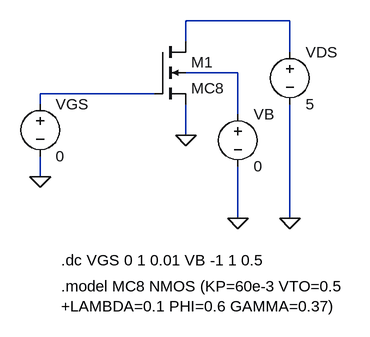
[diagram p0: schematic MOSFET_transfer_body_effect.asc]
MOSFET_transfer_body_effect.asc, the LTspice schematic file:
Version 4
SHEET 1 1412 680
WIRE 320 80 160 80
WIRE 160 112 160 80
WIRE 320 128 320 80
WIRE 240 160 160 160
WIRE 112 192 -64 192
WIRE -64 208 -64 192
WIRE 240 224 240 160
WIRE 160 256 160 208
WIRE -64 320 -64 288
WIRE 240 384 240 304
WIRE 320 384 320 208
FLAG -64 320 0
FLAG 320 384 0
FLAG 240 384 0
FLAG 160 256 0
SYMBOL voltage -64 192 R0
WINDOW 123 0 0 Left 0
WINDOW 39 0 0 Left 0
SYMATTR InstName VGS
SYMATTR Value 0
SYMBOL voltage 320 112 R0
WINDOW 123 0 0 Left 0
WINDOW 39 0 0 Left 0
SYMATTR InstName VDS
SYMATTR Value 5
SYMBOL nmos4 112 112 R0
SYMATTR InstName M1
SYMATTR Value MC8
SYMBOL voltage 240 208 R0
WINDOW 123 0 0 Left 0
WINDOW 39 0 0 Left 0
SYMATTR InstName VB
SYMATTR Value 0
TEXT -32 448 Left 2 !.dc VGS 0 1 0.01 VB -1 1 0.5
TEXT -32 488 Left 2 !.model MC8 NMOS (KP=60e-3 VTO=0.5 \n+LAMBDA=0.1 PHI=0.6 GAMMA=0.37)

The netlist it stands for:
* MOSFET_transfer_body_effect.asc
VGS N003 0 0
VDS N001 0 5
M1 N001 N003 0 N002 MC8
VB N002 0 0
.model NMOS NMOS
.model PMOS PMOS
.lib standard.mos
.dc VGS 0 1 0.01 VB -1 1 0.5
.model MC8 NMOS (KP=60e-3 VTO=0.5
+LAMBDA=0.1 PHI=0.6 GAMMA=0.37)
.backanno
.end